# Altium schematic sheet 4-Memorie.SchDoc
size A4
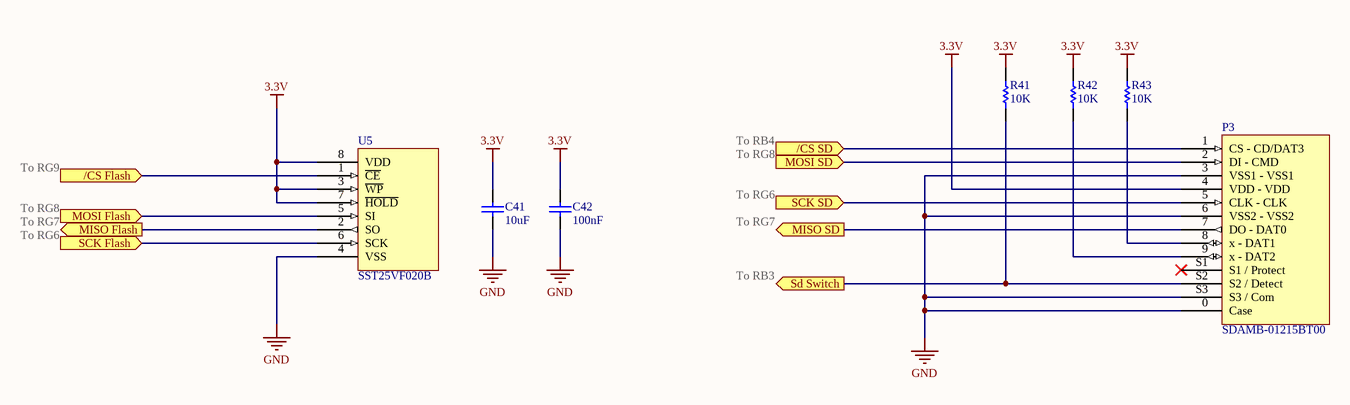
[diagram p0: 4-Memorie.SchDoc]

## Parts
C41  10uF  [capa 1206]
C42  100nF  [capa 1206]
P3  SDAMB-01215BT00
R41  10K  [RES 1206]
R42  10K  [RES 1206]
R43  10K  [RES 1206]
U5  SST25VF020B  [SST25VF020B]

## Ports
/CS Flash (in), /CS SD (in), MISO Flash (out), MISO SD (out), MOSI Flash (in), MOSI SD (in), SCK Flash (in), SCK SD (in), Sd Switch (out)

## Nets
3.3V: C41.1 C42.1 P3.4(VDD_-_VDD) R41.2 R42.2 R43.2 U5.3(~{WP}) U5.7(~{HOLD}) U5.8(VDD)
GND: C41.2 C42.2 P3.0(Case) P3.3(VSS1_-_VSS1) P3.6(VSS2_-_VSS2) P3.S3(S3_/_Com) U5.4(VSS)
/CS Flash: U5.1(~{CE}) ; port /CS Flash
/CS SD: P3.1(CS_-_CD/DAT3) ; port /CS SD
MISO Flash: U5.2(SO) ; port MISO Flash
MISO SD: P3.7(DO_-_DAT0) ; port MISO SD
MOSI Flash: U5.5(SI) ; port MOSI Flash
MOSI SD: P3.2(DI_-_CMD) ; port MOSI SD
SCK Flash: U5.6(SCK) ; port SCK Flash
SCK SD: P3.5(CLK_-_CLK) ; port SCK SD
Sd Switch: P3.S2(S2_/_Detect) R41.1 ; port Sd Switch
NetP3_8: P3.8(x_-_DAT1) R43.1
NetP3_9: P3.9(x_-_DAT2) R42.1

Not connected (* = marked no-connect by the designer): P3 S1(S1_/_Protect)*

## Notes on the sheet
- To RG9
- To RB4
- To RG8
- To RG7
- To RG6
- To RB3

## Library data of the parts
C41 = Cap: Capacitor; Fabricant: MULTICOMP; Fournisseur: Farnell; RefFabricant: MC1206X106K160CT; RefFournisseur: 2320922
C42 = Cap: Capacitor; Fabricant: MULTICOMP; Fournisseur: Farnell; RefFabricant: MC1206B104K500CT; RefFournisseur: 1759361
P3 = SDAMB-01215BT00: Fabricant: MULTICOMP; Fournisseur: Farnell; RefFournisseur: 9186140; RefFabricant: SDAMB-01215BT00
R41-R43 = Res1: Resistor; Fabricant: MULTICOMP; Fournisseur: Farnell; RefFabricant: MC0125W1206510K; RefFournisseur: 9337016
U5 = SST25VF020B: Fabricant: MICROCHIP; Fournisseur: Farnell; RefFabricant: SST25VF020B-80-4I-SAE; RefFournisseur: 1829953